# EAGLE schematic whisker_module (EAGLE 6.3)
Proximity Module -- manages data from 8 external bumpers and 3 ultrasonic sensors. All bumper inputs are sent through a low-pass filter (0.1uF cap) and a schmitt trigger/inverter to smooth the signals. This module is a 5V system that uses a custom level converter for the SDA and SCL lines to make the 5V system work with the 3.3V systems. The ultrasonic sensors are connected directly to a digital pin. All power in this system is smoothed for low-pass and high-pass noise.
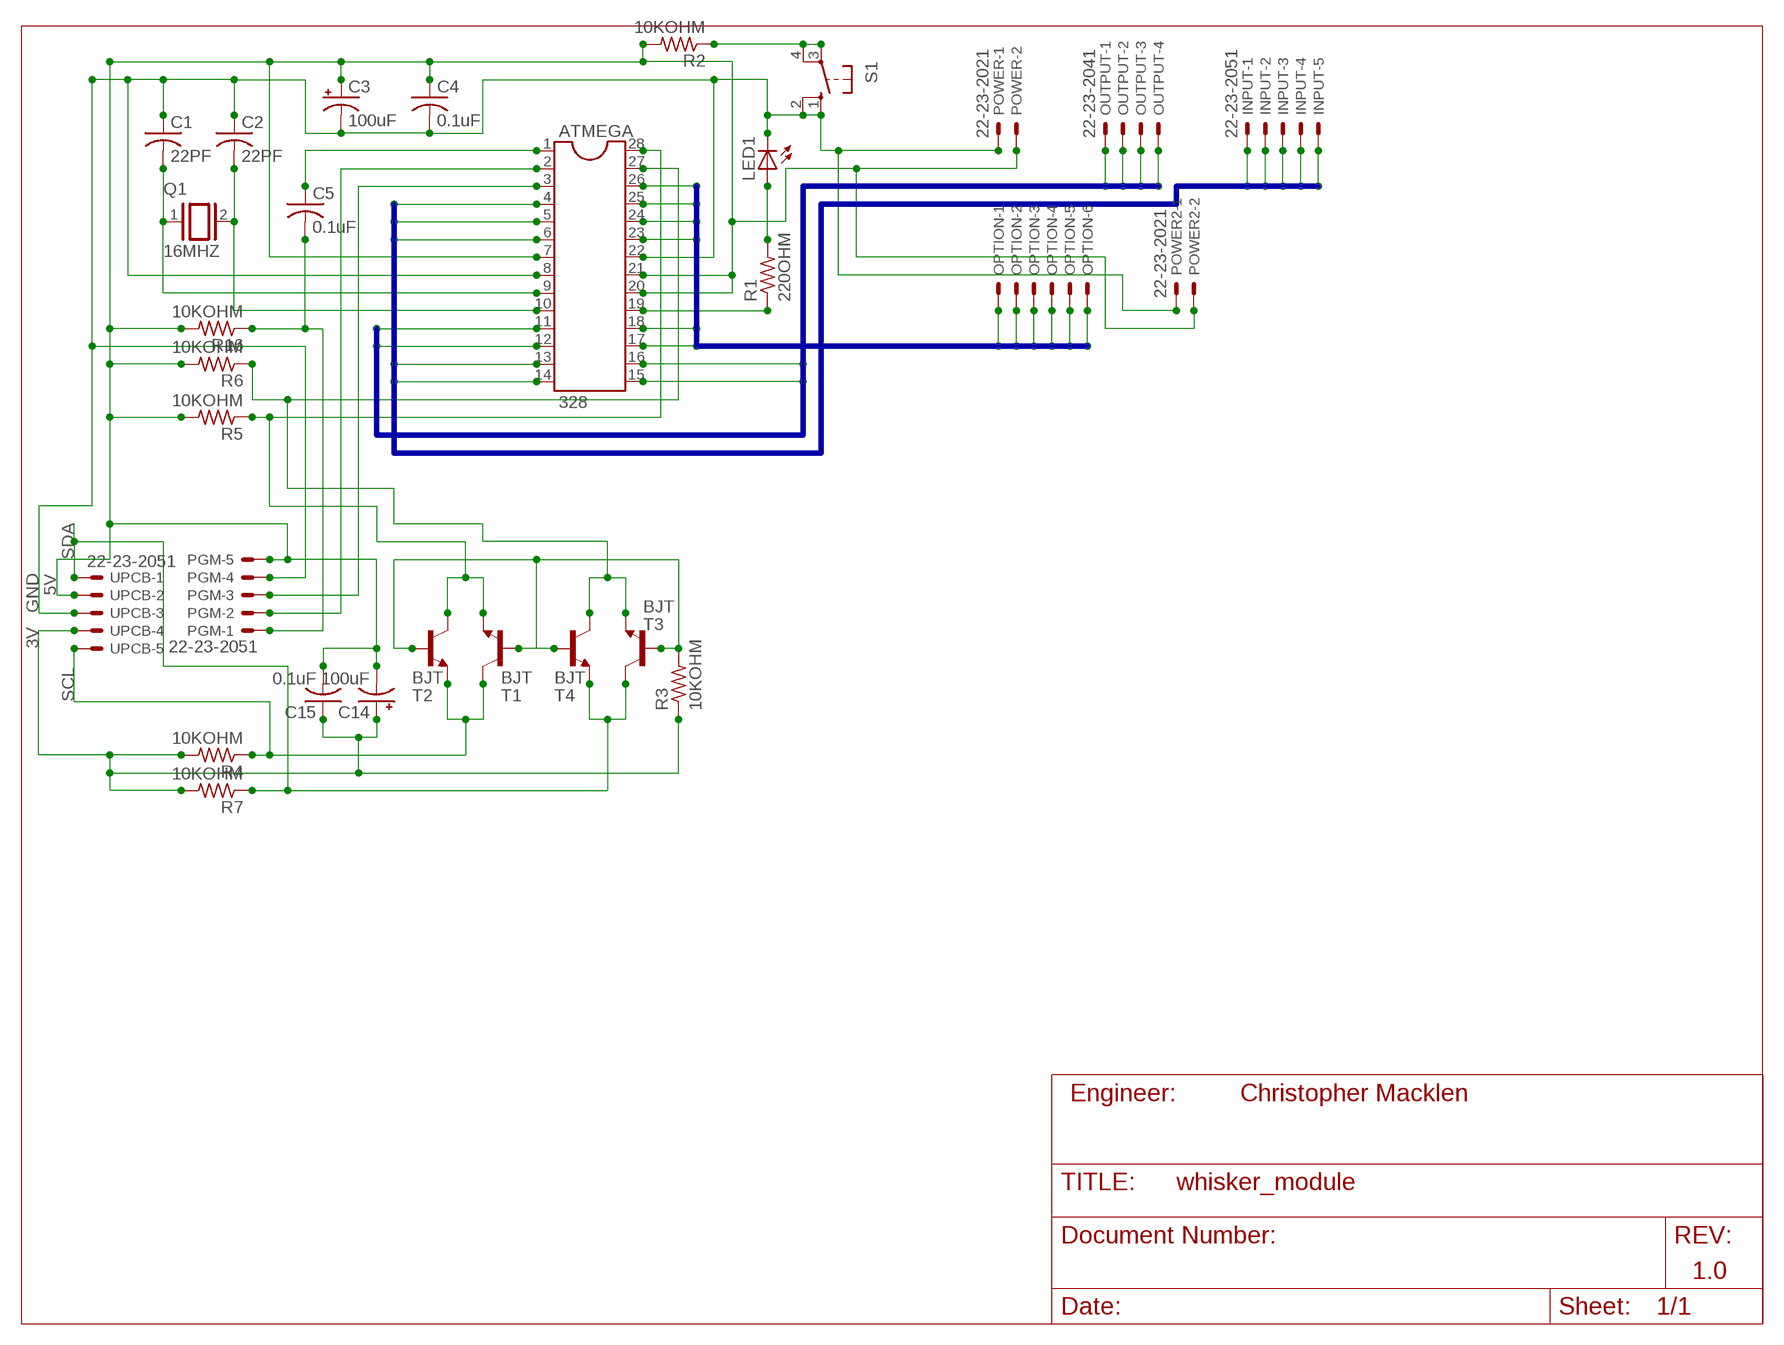
[diagram p0: schematic, sheet 1]

## Parts
ATMEGA  328  DIL28  [DIL28-6]
C1  22PF  C-US025-024X044  [C025-024X044]
C2  22PF  C-US025-024X044  [C025-024X044]
C3  100uF  CPOL-USE2-5  [E2-5]
C4  0.1uF  C-US025-024X044  [C025-024X044]
C5  0.1uF  C-US025-024X044  [C025-024X044]
C14  100uF  CPOL-USE2-5  [E2-5]
C15  0.1uF  C-US025-024X044  [C025-024X044]
INPUT  22-23-2051  [22-23-2051]
LED1  LED3MM  [LED3MM]
OPTION  22-23-2061  [22-23-2061]
OUTPUT  22-23-2041  [22-23-2041]
PGM  22-23-2051  [22-23-2051]
POWER  22-23-2021  [22-23-2021]
POWER2  22-23-2021  [22-23-2021]
Q1  16MHZ  XTAL/S  [QS]
R1  220OHM  R-US_0204/7  [0204/7]
R2  10KOHM  R-US_0204/7  [0204/7]
R3  10KOHM  R-US_0204/7  [0204/7]
R4  10KOHM  R-US_0204/7  [0204/7]
R5  10KOHM  R-US_0204/7  [0204/7]
R6  10KOHM  R-US_0204/7  [0204/7]
R7  10KOHM  R-US_0204/7  [0204/7]
R16  10KOHM  R-US_0204/7  [0204/7]
S1  10-XX  [B3F-10XX]
T1  BJT  -NPN-TO92-E1  [TO92-E1]
T2  BJT  -NPN-TO92-E1  [TO92-E1]
T3  BJT  -NPN-TO92-E1  [TO92-E1]
T4  BJT  -NPN-TO92-E1  [TO92-E1]
UPCB  22-23-2051  [22-23-2051]

## Nets
3V: C14.+ C15.1 R3.1 R4.2 R7.2 UPCB.4
5V: ATMEGA.7 ATMEGA.20 ATMEGA.21 C3.+ C4.1 C14.- C15.2 PGM.5 POWER2.2 POWER.2 R2.2 R5.2 R6.2 R16.2 UPCB.2
CLK-1: ATMEGA.9 C1.2 Q1.1
CLK-2: ATMEGA.10 C2.2 Q1.2
GND: ATMEGA.8 ATMEGA.22 C1.1 C2.1 C3.- C4.2 LED1.K(C) PGM.4 POWER2.1 POWER.1 S1.1(S) S1.2(S1) UPCB.3
I2C-EN: R3.2 T1.2(B) T2.2(B) T3.2(B) T4.2(B)
IN1: ATMEGA.4 INPUT.1
IN2: ATMEGA.5 INPUT.2
IN3: ATMEGA.6 INPUT.3
IN4: ATMEGA.13 INPUT.4
IN5: ATMEGA.14 INPUT.5
LEDNET-1: ATMEGA.19 R1.1
LEDNET-2: LED1.A R1.2
OPTION1: ATMEGA.26 OPTION.1
OPTION2: ATMEGA.25 OPTION.2
OPTION3: ATMEGA.24 OPTION.3
OPTION4: ATMEGA.23 OPTION.4
OPTION5: ATMEGA.18 OPTION.5
OPTION6: ATMEGA.17 OPTION.6
OUT1: ATMEGA.11 OUTPUT.1
OUT2: ATMEGA.12 OUTPUT.2 OUTPUT.3
OUT3: ATMEGA.15
OUT4: ATMEGA.16 OUTPUT.4
RST-1: C5.2 PGM.1 R16.1
RST-2: ATMEGA.1 C5.1
RST-SW: R2.1 S1.3(P) S1.4(P1)
RX-TX: ATMEGA.3 PGM.3
SCL: R4.1 T1.1(C) T2.3(E) UPCB.5
SCL-5V: ATMEGA.28 R5.1 T1.3(E) T2.1(C)
SDA: R7.1 T3.1(C) T4.3(E) UPCB.1
SDA-5V: ATMEGA.27 R6.1 T3.3(E) T4.1(C)
TX-RX: ATMEGA.2 PGM.2

## Buses
OUT[1..4]
IN[1..5]
OPTION[1..6]

## Notes on the sheet
- Engineer: | Christopher Macklen
- 1.0

## Library data of the parts
ATMEGA = ic-package:DIL28: Dual In Line
C1 C2 C4 C5 C15 = rcl:C-US: CAPACITOR, American symbol
C3 C14 = rcl:CPOL-US: POLARIZED CAPACITOR, American symbol
INPUT PGM UPCB = con-molex:22-23-2051: .100" (2.54mm) Center Header - 5 Pin; MF: MOLEX; MPN: 22-23-2051; OC_FARNELL: 1462952; OC_NEWARK: 38C9178
LED1 = led:LED: LED OSRAM: - CHIPLED LG R971, LG N971, LY N971, LG Q971, LY Q971, LO R971, LY R971 LH N974, LH R974 LS Q976, LO Q976, LY Q976 LO Q996 - Hyper CHIPLED LW Q18S LB Q993, LB Q99A, LB R99A - SideLED LS A670, LO A670, LY A670, LG A670, LP A670 LB A673, LV A673, LT A673, LW A673 LH A674 LY A675 LS A676, LA A676, LO A676, LY A676, LW A676 LS A679, LY A679, LG A679 - Hyper Micro SIDELED® LS Y876, LA Y876, LO Y876, LY Y876 LT Y87S - SmartLED LW L88C, LW L88S LB L89C, LB L89S, LG L890 LS L89K, LO L89K, LY L89K LS L896, LA L896, LO L896, LY L896 - TOPLED LS T670, LO T670, LY T670, LG T670, LP T670 LSG T670, LSP T670, LSY T670, LOP T670, LYG T670 LG T671, LOG T671, LSG T671 LB T673, LV T673, LT T673, LW T673 LH T674 LS T676, LA T676, LO T676, LY T676, LB T676, LH T676, LSB T676, LW T676 LB T67C, LV T67C, LT T67C, LS T67K, LO T67K, LY T67K, LW E67C LS E67B, LA E67B, LO E67B, LY E67B, LB E67C, LV E67C, LT E67C LW T67C LS T679, LY T679, LG T679 LS T770, LO T770, LY T770, LG T770, LP T770 LB T773, LV T773, LT T773, LW T773 LH T774 LS E675, LA E675, LY E675, LS T675 LS T776, LA T776, LO T776, LY T776, LB T776 LHGB T686 LT T68C, LB T68C - Hyper Mini TOPLED® LB M676 - Mini TOPLED Santana® LG M470 LS M47K, LO M47K, LY M47K Source: http://www.osram.convergy.de LUXEON: - LUMILED® LXK2-PW12-R00, LXK2-PW12-S00, LXK2-PW14-U00, LXK2-PW14-V00 LXK2-PM12-R00, LXK2-PM12-S00, LXK2-PM14-U00 LXK2-PE12-Q00, LXK2-PE12-R00, LXK2-PE12-S00, LXK2-PE14-T00, LXK2-PE14-U00 LXK2-PB12-K00, LXK2-PB12-L00, LXK2-PB12-M00, LXK2-PB14-N00, LXK2-PB14-P00, LXK2-PB14-Q00 LXK2-PR12-L00, LXK2-PR12-M00, LXK2-PR14-Q00, LXK2-PR14-R00 LXK2-PD12-Q00, LXK2-PD12-R00, LXK2-PD12-S00 LXK2-PH12-R00, LXK2-PH12-S00 LXK2-PL12-P00, LXK2-PL12-Q00, LXK2-PL12-R00 Source: www.luxeon.com KINGBRIGHT: KA-3528ASYC Source: www.kingbright.com
OPTION = con-molex:22-23-2061: .100" (2.54mm) Center Header - 6 Pin; MF: MOLEX; MPN: 22-23-2061; OC_FARNELL: 1462922; OC_NEWARK: 27C1933
OUTPUT = con-molex:22-23-2041: .100" (2.54mm) Center Header - 4 Pin; MF: MOLEX; MPN: 22-23-2041; OC_FARNELL: 1462920; OC_NEWARK: 38C0355
POWER POWER2 = con-molex:22-23-2021: .100" (2.54mm) Center Header - 2 Pin; MF: MOLEX; MPN: 22-23-2021; OC_FARNELL: 1462926; OC_NEWARK: 25C3832
Q1 = special:XTAL/S: CRYSTAL
R1-R7 R16 = rcl:R-US_: RESISTOR, American symbol
S1 = switch-omron:10-XX: OMRON SWITCH; MPN: B3F-1000; OC_FARNELL: 176432; OC_NEWARK: 36M3542
T1-T4 = transistor:*-NPN-: NPN Transistror BF959 corrected 2008.03.06